# EAGLE schematic sensor (EAGLE 9.2.2)
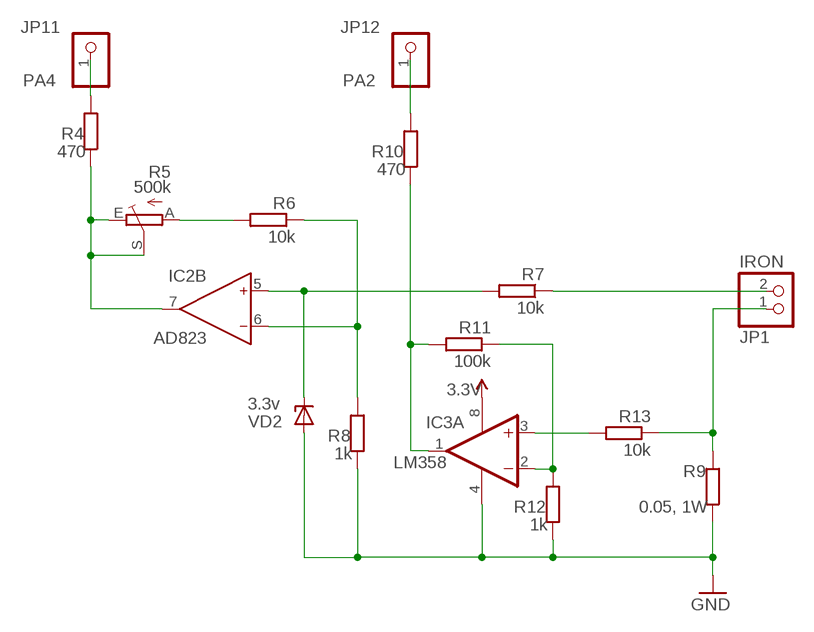
[diagram p0: schematic, sheet 1]

## Parts
IC2  AD823  AD822N  [DIL08]
IC3  LM358  MCP602P  [DIL08]
JP1  IRON  PINHD-1X2  [1X02]
JP11  PA4  PINHD-1X1  [1X01]
JP12  PA2  PINHD-1X1  [1X01]
R4  470  R-EU_0204/5  [0204/5]
R5  500k  TRIM_EU-B64Y  [B64Y]
R6  10k  R-EU_0204/5  [0204/5]
R7  10k  R-EU_0204/5  [0204/5]
R8  1k  R-EU_0204/5  [0204/5]
R9  0.05, 1W  R-EU_0204/5  [0204/5]
R10  470  R-EU_0204/5  [0204/5]
R11  100k  R-EU_0204/5  [0204/5]
R12  1k  R-EU_0204/5  [0204/5]
R13  10k  R-EU_0204/5  [0204/5]
VD2  3.3v  ZENER-DIODEC1702-15  [C1702-15]

## Nets
3.3V: IC3.8(P:V+)
GND: IC3.4(P:V-) R8.1 R9.1 R12.1 VD2.A
N$1: JP1.1 R9.2 R13.1
N$2: IC3.3(A:+IN) R13.2
N$3: IC3.2(A:-IN) R11.1 R12.2
N$4: IC3.1(A:OUT) R10.1 R11.2
N$5: IC2.5(B:IN+) R7.2 VD2.C
N$7: JP1.2 R7.1
N$8: JP12.1 R10.2
N$9: JP11.1 R4.2
N$10: R5.A R6.2
N$11: IC2.7(B:OUT) R4.1 R5.E R5.S
N$12: IC2.6(B:IN-) R6.1 R8.2
Unconnected: IC2.1(A:OUT) IC2.2(A:IN-) IC2.3(A:IN+) IC3.5(B:+IN) IC3.6(B:-IN) IC3.7(B:OUT)

## Power pins joined to a net without a drawn wire
V+: IC2.8(P:V+)
V-: IC2.4(P:V-)

## Library data of the parts
IC2 = analog-devices:AD822: Single-Supply, Rail-to-Rail Low Power FET-Input Op Amp Source: http://www.analog.com/static/imported-files/data_sheets/AD822.pdf; OC_FARNELL: 1438581; OC_NEWARK: unknown
IC3 = linear:MCP602: Single Op Amp 2.7V to 6.0V Single Supply CMOS Source: http://ww1.microchip.com/downloads/en/DeviceDoc/21314g.pdf
JP1 = pinhead:PINHD-1X2: PIN HEADER
JP11 JP12 = pinhead:PINHD-1X1: PIN HEADER
R4 R6-R13 = rcl:R-EU_: RESISTOR, European symbol; SPICEPREFIX: R
R5 = pot:TRIM_EU-: POTENTIOMETER
VD2 = diode:ZENER-DIODE: Z-Diode